# Altium project wikitoy-scr016.PrjPCB
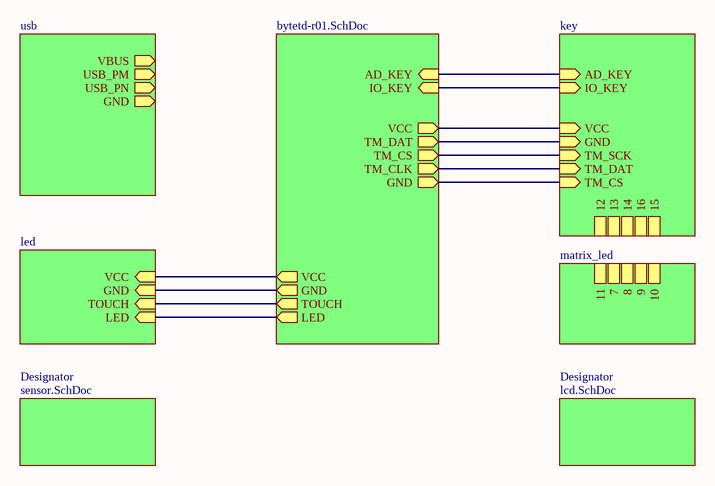
[diagram p0: wikitoy.SchDoc]
5 sheets, 1 parts. Net scope: hierarchical (ports join the sheet entries above them; power ports are global).
Board file: wikitoy.PcbDoc
Sheets:
  wikitoy.SchDoc
    Designator = bytetd-r01.SchDoc
    Designator = usb.SchDoc
    Designator = sensor.SchDoc
    Designator = lcd.SchDoc

## Sheet wikitoy.SchDoc
size A4

### Sub-sheets
Designator = bytetd-r01.SchDoc: AD_KEY (in), IO_KEY (in), VCC (out), GND (out), TM_DAT (out), TM_CS (out), TM_CLK (out), VCC (out), GND (out), TOUCH (out), LED (out)
Designator = key (file not in this document): VCC (in), GND (in), TM_SCK (in), TM_DAT (in), TM_CS (in), 12, 13, 14, 15, 16, AD_KEY (in), IO_KEY (in)
Designator = led (file not in this document): VCC (in), GND (in), TOUCH (in), LED (in)
Designator = usb: VBUS (out), USB_PM (out), USB_PN (out), GND (out)
Designator = matrix_led (file not in this document): 7, 8, 9, 10, 11
Designator = sensor.SchDoc: no entries
Designator = lcd.SchDoc: no entries

### Nets
(unnamed): sheet Designator/AD_KEY, sheet Designator/AD_KEY
(unnamed): sheet Designator/IO_KEY, sheet Designator/IO_KEY
(unnamed): sheet Designator/VCC, sheet Designator/VCC, sheet Designator/VCC, sheet Designator/VCC
(unnamed): sheet Designator/GND, sheet Designator/GND, sheet Designator/TM_CS, sheet Designator/GND
(unnamed): sheet Designator/TM_DAT, sheet Designator/GND
(unnamed): sheet Designator/TM_CS, sheet Designator/TM_SCK
(unnamed): sheet Designator/TM_CLK, sheet Designator/TM_DAT
(unnamed): sheet Designator/TOUCH, sheet Designator/TOUCH
(unnamed): sheet Designator/LED, sheet Designator/LED

## Sheet bytetd-r01.SchDoc
size A4
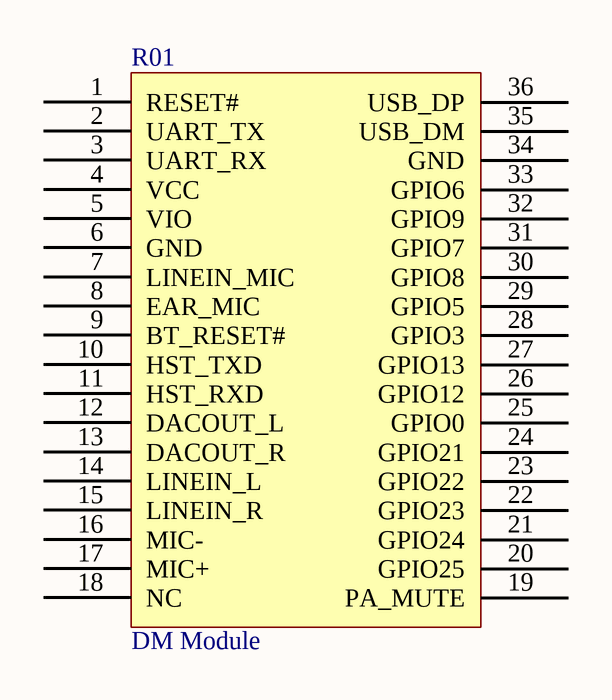
[diagram p1: bytetd-r01.SchDoc]

### Parts
R01  DM Module  [R01]

### Nets

Not connected (* = marked no-connect by the designer): R01 1(RESET#) 2(UART_TX) 3(UART_RX) 4(VCC) 5(VIO) 6(GND) 7(LINEIN_MIC) 8(EAR_MIC) 9(BT_RESET#) 10(HST_TXD) 11(HST_RXD) 12(DACOUT_L) 13(DACOUT_R) 14(LINEIN_L) 15(LINEIN_R) 16(MIC-) 17(MIC+) 18(NC) 19(PA_MUTE) 20(GPIO25) 21(GPIO24) 22(GPIO23) 23(GPIO22) 24(GPIO21) 25(GPIO0) 26(GPIO12) 27(GPIO13) 28(GPIO3) 29(GPIO5) 30(GPIO8) 31(GPIO7) 32(GPIO9) 33(GPIO6) 34(GND) 35(USB_DM) 36(USB_DP)

### Library data of the parts
R01 = R01: Wi-Fi BT Module

## Sheet usb.SchDoc
size A4

## Sheet sensor.SchDoc
size A4

## Sheet lcd.SchDoc
size A4